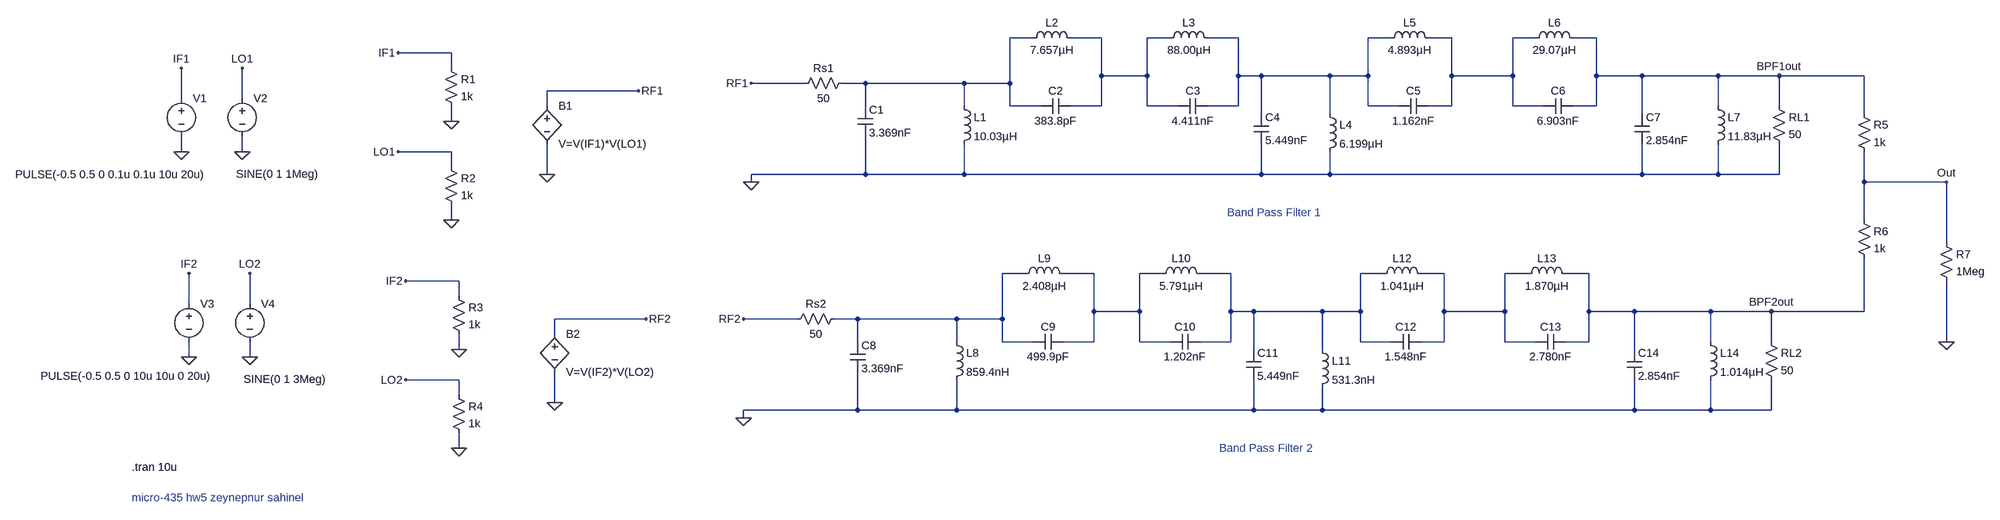
[diagram p0: schematic micro-435 hw5 final.asc]
micro-435 hw5 final.asc, the LTspice schematic file:
Version 4
SHEET 1 1976 680
WIRE -400 -320 -448 -320
WIRE -256 -320 -320 -320
WIRE -112 -320 -160 -320
WIRE 32 -320 -32 -320
WIRE 352 -320 304 -320
WIRE 480 -320 432 -320
WIRE 656 -320 608 -320
WIRE 784 -320 736 -320
WIRE -1712 -288 -1824 -288
WIRE -1712 -256 -1712 -288
WIRE -256 -240 -256 -320
WIRE -160 -240 -160 -320
WIRE -160 -240 -256 -240
WIRE 32 -240 32 -320
WIRE 80 -240 32 -240
WIRE 224 -240 80 -240
WIRE 304 -240 304 -320
WIRE 304 -240 224 -240
WIRE 480 -240 480 -320
WIRE 608 -240 608 -320
WIRE 608 -240 480 -240
WIRE 784 -240 784 -320
WIRE 880 -240 784 -240
WIRE 1040 -240 880 -240
WIRE 1168 -240 1040 -240
WIRE 1552 -240 1168 -240
WIRE -880 -224 -992 -224
WIRE -752 -224 -800 -224
WIRE -544 -224 -752 -224
WIRE -448 -224 -448 -320
WIRE -448 -224 -544 -224
WIRE -1312 -208 -1504 -208
WIRE -2416 -192 -2416 -256
WIRE -2288 -192 -2288 -256
WIRE -1504 -176 -1504 -208
WIRE -752 -176 -752 -224
WIRE -544 -176 -544 -224
WIRE -448 -176 -448 -224
WIRE -384 -176 -448 -176
WIRE -256 -176 -256 -240
WIRE -256 -176 -320 -176
WIRE -160 -176 -160 -240
WIRE -96 -176 -160 -176
WIRE 32 -176 32 -240
WIRE 32 -176 -32 -176
WIRE 304 -176 304 -240
WIRE 368 -176 304 -176
WIRE 480 -176 480 -240
WIRE 480 -176 432 -176
WIRE 608 -176 608 -240
WIRE 672 -176 608 -176
WIRE 784 -176 784 -240
WIRE 784 -176 736 -176
WIRE 1040 -176 1040 -240
WIRE 1168 -176 1168 -240
WIRE 80 -160 80 -240
WIRE 224 -160 224 -240
WIRE 880 -160 880 -240
WIRE 1552 -160 1552 -240
WIRE -1712 -144 -1712 -176
WIRE -2416 -80 -2416 -112
WIRE -2288 -80 -2288 -112
WIRE -1712 -80 -1824 -80
WIRE -1712 -48 -1712 -80
WIRE -1504 -32 -1504 -96
WIRE -752 -32 -752 -112
WIRE -752 -32 -992 -32
WIRE -544 -32 -544 -96
WIRE -544 -32 -752 -32
WIRE 80 -32 80 -96
WIRE 80 -32 -544 -32
WIRE 224 -32 224 -80
WIRE 224 -32 80 -32
WIRE 880 -32 880 -96
WIRE 880 -32 224 -32
WIRE 1040 -32 1040 -96
WIRE 1040 -32 880 -32
WIRE 1168 -32 1168 -96
WIRE 1168 -32 1040 -32
WIRE -992 -16 -992 -32
WIRE 1552 -16 1552 -80
WIRE 1888 -16 1552 -16
WIRE -1712 64 -1712 32
WIRE 1552 64 1552 -16
WIRE 1888 112 1888 -16
WIRE -416 176 -464 176
WIRE -272 176 -336 176
WIRE -128 176 -176 176
WIRE 16 176 -48 176
WIRE 336 176 288 176
WIRE 464 176 416 176
WIRE 640 176 592 176
WIRE 768 176 720 176
WIRE -1696 192 -1808 192
WIRE -1696 224 -1696 192
WIRE -2400 240 -2400 176
WIRE -2272 240 -2272 176
WIRE -272 256 -272 176
WIRE -176 256 -176 176
WIRE -176 256 -272 256
WIRE 16 256 16 176
WIRE 64 256 16 256
WIRE 208 256 64 256
WIRE 288 256 288 176
WIRE 288 256 208 256
WIRE 464 256 464 176
WIRE 592 256 592 176
WIRE 592 256 464 256
WIRE 768 256 768 176
WIRE 864 256 768 256
WIRE 1024 256 864 256
WIRE 1152 256 1024 256
WIRE 1552 256 1552 144
WIRE 1552 256 1152 256
WIRE -1296 272 -1488 272
WIRE -896 272 -1008 272
WIRE -768 272 -816 272
WIRE -560 272 -768 272
WIRE -464 272 -464 176
WIRE -464 272 -560 272
WIRE -1488 304 -1488 272
WIRE -768 320 -768 272
WIRE -560 320 -560 272
WIRE -464 320 -464 272
WIRE -400 320 -464 320
WIRE -272 320 -272 256
WIRE -272 320 -336 320
WIRE -176 320 -176 256
WIRE -112 320 -176 320
WIRE 16 320 16 256
WIRE 16 320 -48 320
WIRE 288 320 288 256
WIRE 352 320 288 320
WIRE 464 320 464 256
WIRE 464 320 416 320
WIRE 592 320 592 256
WIRE 656 320 592 320
WIRE 768 320 768 256
WIRE 768 320 720 320
WIRE 1024 320 1024 256
WIRE 1152 320 1152 256
WIRE 1888 320 1888 192
WIRE -1696 336 -1696 304
WIRE 64 336 64 256
WIRE 208 336 208 256
WIRE 864 336 864 256
WIRE -2400 352 -2400 320
WIRE -2272 352 -2272 320
WIRE -1696 400 -1808 400
WIRE -1696 432 -1696 400
WIRE -1488 448 -1488 384
WIRE -768 464 -768 384
WIRE -768 464 -1008 464
WIRE -560 464 -560 400
WIRE -560 464 -768 464
WIRE 64 464 64 400
WIRE 64 464 -560 464
WIRE 208 464 208 416
WIRE 208 464 64 464
WIRE 864 464 864 400
WIRE 864 464 208 464
WIRE 1024 464 1024 400
WIRE 1024 464 864 464
WIRE 1152 464 1152 400
WIRE 1152 464 1024 464
WIRE -1008 480 -1008 464
WIRE -1696 544 -1696 512
FLAG -992 -16 0
FLAG 1168 -240 BPF1out
FLAG -1008 480 0
FLAG 1152 256 BPF2out
FLAG -1712 -144 0
FLAG -1824 -288 IF1
FLAG -1712 64 0
FLAG -1824 -80 LO1
FLAG -1504 -32 0
FLAG -1312 -208 RF1
FLAG -2416 -80 0
FLAG -2288 -80 0
FLAG -2416 -256 IF1
FLAG -2288 -256 LO1
FLAG -1696 336 0
FLAG -1808 192 IF2
FLAG -1696 544 0
FLAG -1808 400 LO2
FLAG -1488 448 0
FLAG -1296 272 RF2
FLAG -2400 352 0
FLAG -2272 352 0
FLAG -2400 176 IF2
FLAG -2272 176 LO2
FLAG -992 -224 RF1
FLAG -1008 272 RF2
FLAG 1888 320 0
FLAG 1888 -16 Out
SYMBOL res -784 -240 R90
WINDOW 0 0 56 VBottom 2
WINDOW 3 32 56 VTop 2
SYMATTR InstName Rs1
SYMATTR Value 50
SYMBOL cap -768 -176 R0
SYMATTR InstName C1
SYMATTR Value 3.369nF
SYMBOL ind -560 -192 R0
SYMATTR InstName L1
SYMATTR Value 10.03µH
SYMBOL ind -416 -304 R270
WINDOW 0 32 56 VTop 2
WINDOW 3 5 56 VBottom 2
SYMATTR InstName L2
SYMATTR Value 7.657µH
SYMBOL cap -320 -192 R90
WINDOW 0 0 32 VBottom 2
WINDOW 3 32 32 VTop 2
SYMATTR InstName C2
SYMATTR Value 383.8pF
SYMBOL ind -128 -304 R270
WINDOW 0 32 56 VTop 2
WINDOW 3 5 56 VBottom 2
SYMATTR InstName L3
SYMATTR Value 88.00µH
SYMBOL cap -96 -160 R270
WINDOW 0 32 32 VTop 2
WINDOW 3 0 32 VBottom 2
SYMATTR InstName C3
SYMATTR Value 4.411nF
SYMBOL cap 64 -160 R0
SYMATTR InstName C4
SYMATTR Value 5.449nF
SYMBOL ind 208 -176 R0
SYMATTR InstName L4
SYMATTR Value 6.199µH
SYMBOL ind 336 -304 R270
WINDOW 0 32 56 VTop 2
WINDOW 3 5 56 VBottom 2
SYMATTR InstName L5
SYMATTR Value 4.893µH
SYMBOL cap 432 -192 R90
WINDOW 0 0 32 VBottom 2
WINDOW 3 32 32 VTop 2
SYMATTR InstName C5
SYMATTR Value 1.162nF
SYMBOL ind 640 -304 R270
WINDOW 0 32 56 VTop 2
WINDOW 3 5 56 VBottom 2
SYMATTR InstName L6
SYMATTR Value 29.07µH
SYMBOL cap 672 -160 R270
WINDOW 0 32 32 VTop 2
WINDOW 3 0 32 VBottom 2
SYMATTR InstName C6
SYMATTR Value 6.903nF
SYMBOL cap 864 -160 R0
SYMATTR InstName C7
SYMATTR Value 2.854nF
SYMBOL ind 1024 -192 R0
SYMATTR InstName L7
SYMATTR Value 11.83µH
SYMBOL res 1152 -192 R0
SYMATTR InstName RL1
SYMATTR Value 50
SYMBOL res -800 256 R90
WINDOW 0 0 56 VBottom 2
WINDOW 3 32 56 VTop 2
SYMATTR InstName Rs2
SYMATTR Value 50
SYMBOL cap -784 320 R0
SYMATTR InstName C8
SYMATTR Value 3.369nF
SYMBOL ind -576 304 R0
SYMATTR InstName L8
SYMATTR Value 859.4nH
SYMBOL ind -432 192 R270
WINDOW 0 32 56 VTop 2
WINDOW 3 5 56 VBottom 2
SYMATTR InstName L9
SYMATTR Value 2.408µH
SYMBOL cap -336 304 R90
WINDOW 0 0 32 VBottom 2
WINDOW 3 32 32 VTop 2
SYMATTR InstName C9
SYMATTR Value 499.9pF
SYMBOL ind -144 192 R270
WINDOW 0 32 56 VTop 2
WINDOW 3 5 56 VBottom 2
SYMATTR InstName L10
SYMATTR Value 5.791µH
SYMBOL cap -112 336 R270
WINDOW 0 32 32 VTop 2
WINDOW 3 0 32 VBottom 2
SYMATTR InstName C10
SYMATTR Value 1.202nF
SYMBOL cap 48 336 R0
SYMATTR InstName C11
SYMATTR Value 5.449nF
SYMBOL ind 192 320 R0
SYMATTR InstName L11
SYMATTR Value 531.3nH
SYMBOL ind 320 192 R270
WINDOW 0 32 56 VTop 2
WINDOW 3 5 56 VBottom 2
SYMATTR InstName L12
SYMATTR Value 1.041µH
SYMBOL cap 416 304 R90
WINDOW 0 0 32 VBottom 2
WINDOW 3 32 32 VTop 2
SYMATTR InstName C12
SYMATTR Value 1.548nF
SYMBOL ind 624 192 R270
WINDOW 0 32 56 VTop 2
WINDOW 3 5 56 VBottom 2
SYMATTR InstName L13
SYMATTR Value 1.870µH
SYMBOL cap 656 336 R270
WINDOW 0 32 32 VTop 2
WINDOW 3 0 32 VBottom 2
SYMATTR InstName C13
SYMATTR Value 2.780nF
SYMBOL cap 848 336 R0
SYMATTR InstName C14
SYMATTR Value 2.854nF
SYMBOL ind 1008 304 R0
SYMATTR InstName L14
SYMATTR Value 1.014µH
SYMBOL res 1136 304 R0
SYMATTR InstName RL2
SYMATTR Value 50
SYMBOL bv -1504 -192 R0
SYMATTR InstName B1
SYMATTR Value V=V(IF1)*V(LO1)
SYMBOL res -1728 -272 R0
SYMATTR InstName R1
SYMATTR Value 1k
SYMBOL res -1728 -64 R0
SYMATTR InstName R2
SYMATTR Value 1k
SYMBOL voltage -2416 -208 R0
WINDOW 3 -349 176 Left 2
WINDOW 123 0 0 Left 0
WINDOW 39 0 0 Left 0
SYMATTR Value PULSE(-0.5 0.5 0 0.1u 0.1u 10u 20u)
SYMATTR InstName V1
SYMBOL voltage -2288 -208 R0
WINDOW 3 -13 175 Left 2
WINDOW 123 0 0 Left 0
WINDOW 39 0 0 Left 0
SYMATTR Value SINE(0 1 1Meg)
SYMATTR InstName V2
SYMBOL bv -1488 288 R0
SYMATTR InstName B2
SYMATTR Value V=V(IF2)*V(LO2)
SYMBOL res -1712 208 R0
SYMATTR InstName R3
SYMATTR Value 1k
SYMBOL res -1712 416 R0
SYMATTR InstName R4
SYMATTR Value 1k
SYMBOL voltage -2400 224 R0
WINDOW 3 -312 168 Left 2
WINDOW 123 0 0 Left 0
WINDOW 39 0 0 Left 0
SYMATTR Value PULSE(-0.5 0.5 0 10u 10u 0 20u)
SYMATTR InstName V3
SYMBOL voltage -2272 224 R0
WINDOW 3 -13 175 Left 2
WINDOW 123 0 0 Left 0
WINDOW 39 0 0 Left 0
SYMATTR Value SINE(0 1 3Meg)
SYMATTR InstName V4
SYMBOL res 1536 -176 R0
SYMATTR InstName R5
SYMATTR Value 1k
SYMBOL res 1536 48 R0
SYMATTR InstName R6
SYMATTR Value 1k
SYMBOL res 1872 96 R0
SYMATTR InstName R7
SYMATTR Value 1Meg
TEXT 8 48 Left 2 ;Band Pass Filter 1
TEXT -8 544 Left 2 ;Band Pass Filter 2
TEXT -2520 648 Left 2 ;micro-435 hw5 zeynepnur sahinel
TEXT -2520 584 Left 2 !.tran 10u

The netlist it stands for:
* micro-435 hw5 final.asc
Rs1 N001 RF1 50
C1 N001 0 3.369nF
L1 N001 0 10.03µH
L2 N001 N002 7.657µH
C2 N002 N001 383.8pF
L3 N002 N003 88.00µH
C3 N002 N003 4.411nF
C4 N003 0 5.449nF
L4 N003 0 6.199µH
L5 N003 N004 4.893µH
C5 N004 N003 1.162nF
L6 N004 BPF1out 29.07µH
C6 N004 BPF1out 6.903nF
C7 BPF1out 0 2.854nF
L7 BPF1out 0 11.83µH
RL1 BPF1out 0 50
Rs2 N005 RF2 50
C8 N005 0 3.369nF
L8 N005 0 859.4nH
L9 N005 N006 2.408µH
C9 N006 N005 499.9pF
L10 N006 N007 5.791µH
C10 N006 N007 1.202nF
C11 N007 0 5.449nF
L11 N007 0 531.3nH
L12 N007 N008 1.041µH
C12 N008 N007 1.548nF
L13 N008 BPF2out 1.870µH
C13 N008 BPF2out 2.780nF
C14 BPF2out 0 2.854nF
L14 BPF2out 0 1.014µH
RL2 BPF2out 0 50
B1 RF1 0 V=V(IF1)*V(LO1)
R1 IF1 0 1k
R2 LO1 0 1k
V1 IF1 0 PULSE(-0.5 0.5 0 0.1u 0.1u 10u 20u)
V2 LO1 0 SINE(0 1 1Meg)
B2 RF2 0 V=V(IF2)*V(LO2)
R3 IF2 0 1k
R4 LO2 0 1k
V3 IF2 0 PULSE(-0.5 0.5 0 10u 10u 0 20u)
V4 LO2 0 SINE(0 1 3Meg)
R5 BPF1out Out 1k
R6 Out BPF2out 1k
R7 Out 0 1Meg
* Band Pass Filter 1
* Band Pass Filter 2
* micro-435 hw5 zeynepnur sahinel
.tran 10u
.backanno
.end